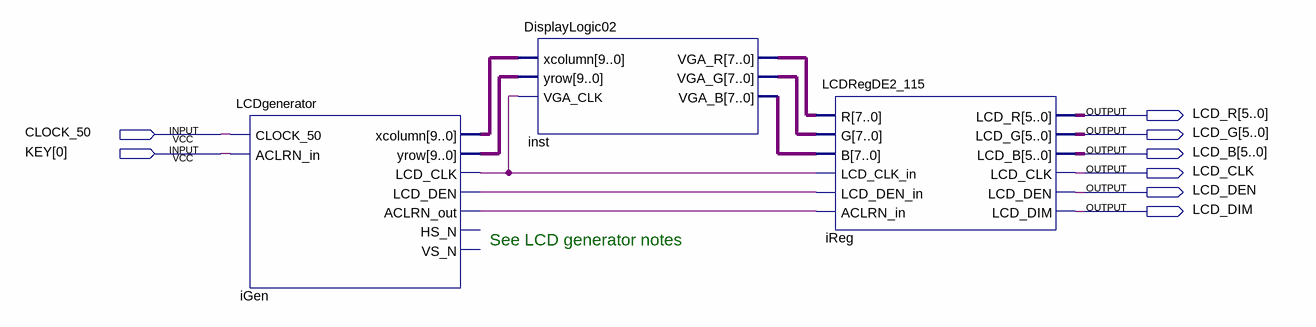
[diagram p0: schematic sheet]
// Quartus schematic Demo_LCD0.bdf as structural Verilog: 3 symbols, 8 pins
module Demo_LCD0 (
  input  CLOCK_50,
  input  [0:0] KEY,
  output [5:0] LCD_R,
  output [5:0] LCD_G,
  output [5:0] LCD_B,
  output LCD_CLK,
  output LCD_DEN,
  output LCD_DIM
);

  wire iGen_aclrn_out, iGen_lcd_clk, iGen_lcd_den;
  wire [7:0] inst_vga_b, inst_vga_g, inst_vga_r;
  wire [9:0] iGen_xcolumn, iGen_yrow;

  LCDgenerator iGen (
    .CLOCK_50(CLOCK_50), .ACLRN_in(KEY[0]), .xcolumn(iGen_xcolumn), .yrow(iGen_yrow), .LCD_CLK(iGen_lcd_clk),
    .LCD_DEN(iGen_lcd_den), .ACLRN_out(iGen_aclrn_out));  // open: HS_N, VS_N
  DisplayLogic02 inst (
    .xcolumn(iGen_xcolumn), .yrow(iGen_yrow), .VGA_CLK(iGen_lcd_clk), .VGA_R(inst_vga_r), .VGA_G(inst_vga_g),
    .VGA_B(inst_vga_b));
  LCDRegDE2_115 iReg (
    .R(inst_vga_r), .G(inst_vga_g), .B(inst_vga_b), .LCD_CLK_in(iGen_lcd_clk), .LCD_DEN_in(iGen_lcd_den),
    .ACLRN_in(iGen_aclrn_out), .LCD_R(LCD_R), .LCD_G(LCD_G), .LCD_B(LCD_B), .LCD_CLK(LCD_CLK),
    .LCD_DEN(LCD_DEN), .LCD_DIM(LCD_DIM));

  // Notes on the sheet:
  //   See LCD generator notes
endmodule
